# Altium schematic sheet TOP.SchDoc
size A4; Organization: Altium Limited; Address1: L3, 12a Rodborough Rd; Address2: Frenchs Forest; Address3: NSW; Address4: Australia 2086
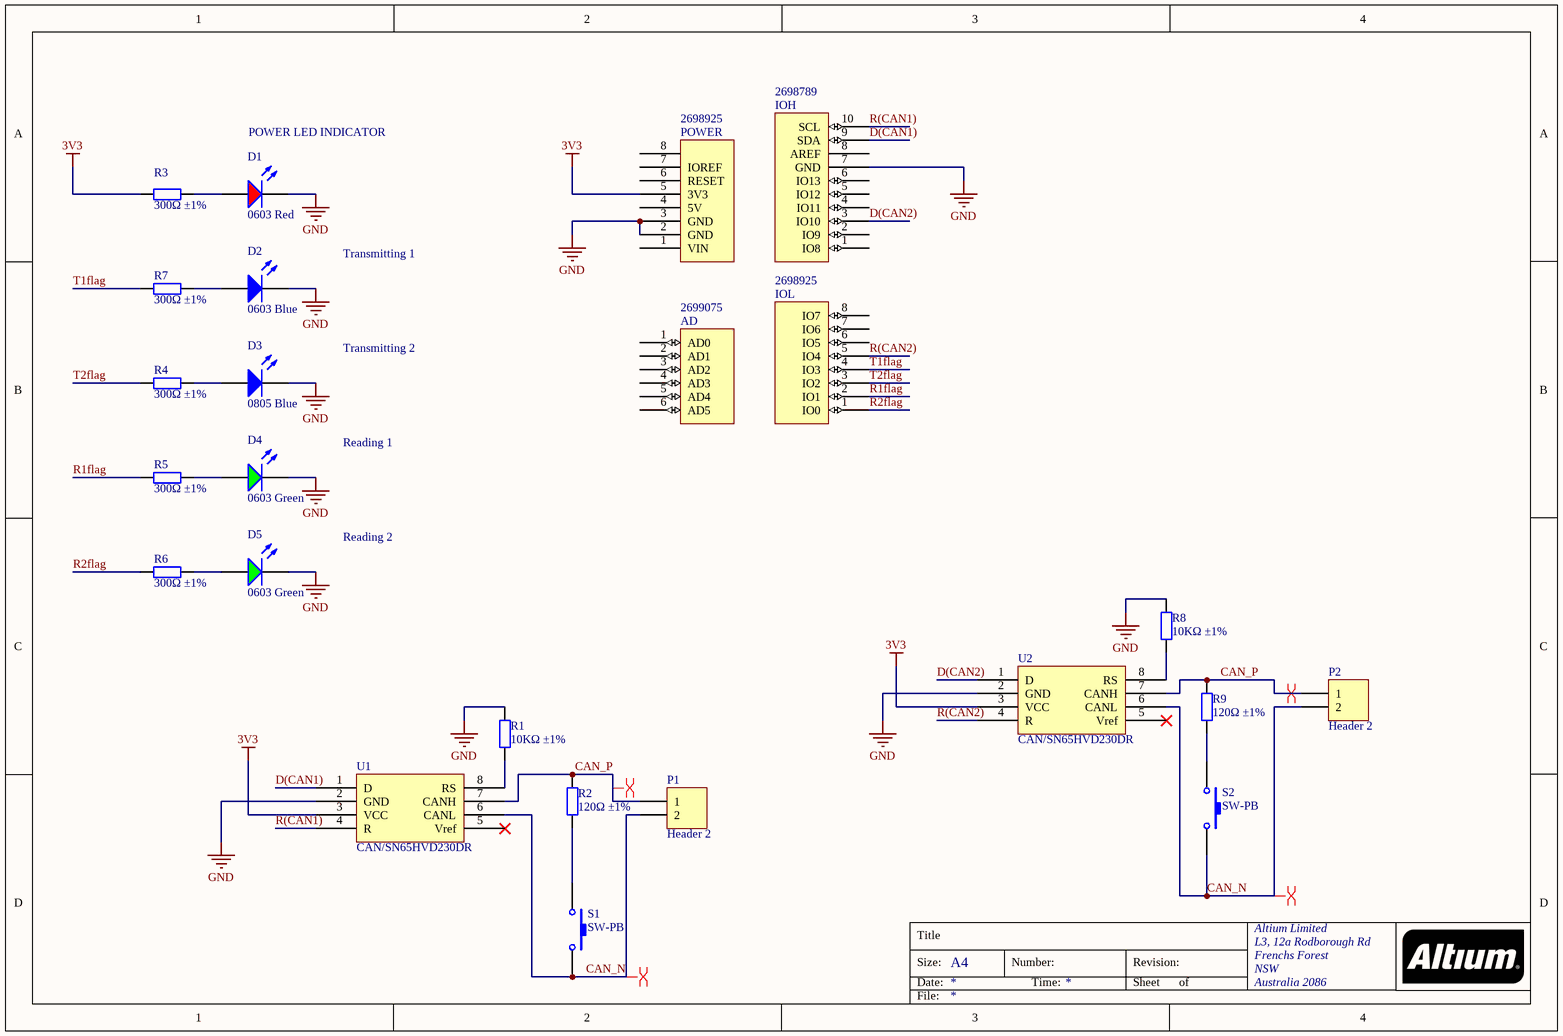
[diagram p0: TOP.SchDoc]

## Parts
AD  Supplier Part Number 4: 2699075  [Header 6x1 8.5mm]  (hidden comment: AD)
D1  0603 Red  [0603_LED_S1]
D2  0603 Blue  [0603_LED_S1]
D3  0805 Blue  [0805_LED_S1]
D4  0603 Green  [0603_LED_S1]
D5  0603 Green  [0603_LED_S1]
IOH  Supplier Part Number 3: 2698789  [Header 10x1 8.5mm]  (hidden comment: IOH)
IOL  Supplier Part Number 4: 2698925  [Header 8x1 8.5mm]  (hidden comment: IOL)
P1  Header 2  [HDR1X2]
P2  Header 2  [HDR1X2]
POWER  Supplier Part Number 4: 2698925  [Header 8x1 8.5mm]  (hidden comment: POWER_UNO)
R1  10KΩ ±1%  [0603_R]
R2  120Ω ±1%  [0603_R]
R3  300Ω ±1%  [0603_R]
R4  300Ω ±1%  [0603_R]
R5  300Ω ±1%  [0603_R]
R6  300Ω ±1%  [0603_R]
R7  300Ω ±1%  [0603_R]
R8  10KΩ ±1%  [0603_R]
R9  120Ω ±1%  [0603_R]
S1  SW-PB  [SPST-2]
S2  SW-PB  [SPST-2]
U1  CAN/SN65HVD230DR  [SOIC-8_150mil]
U2  CAN/SN65HVD230DR  [SOIC-8_150mil]

## Nets
3V3: POWER.5(3V3) R3.1 U1.3(VCC) U2.3(VCC)
GND: D1.K D2.K D3.K D4.K D5.K IOH.7(GND) POWER.2(GND) POWER.3(GND) R1.2 R8.2 U1.2(GND) U2.2(GND)
CAN_N: P1.2 P2.2 S1.2 S2.2 U1.6(CANL) U2.6(CANL)
CAN_P: P1.1 P2.1 R2.2 R9.2 U1.7(CANH) U2.7(CANH)
D(CAN1): IOH.9(SDA) U1.1(D)
D(CAN2): IOH.3(IO10) U2.1(D)
R1flag: IOL.2(IO1) R5.1
R2flag: IOL.1(IO0) R6.1
R(CAN1): IOH.10(SCL) U1.4(R)
R(CAN2): IOL.5(IO4) U2.4(R)
T1flag: IOL.4(IO3) R7.1
T2flag: IOL.3(IO2) R4.1
NetD1_A: D1.A R3.2
NetD2_A: D2.A R7.2
NetD3_A: D3.A R4.2
NetD4_A: D4.A R5.2
NetD5_A: D5.A R6.2
NetR1_1: R1.1 U1.8(RS)
NetR2_1: R2.1 S1.1
NetR8_1: R8.1 U2.8(RS)
NetR9_1: R9.1 S2.1

Not connected (* = marked no-connect by the designer): AD 1(AD0) 2(AD1) 3(AD2) 4(AD3) 5(AD4) 6(AD5); IOH 1(IO8) 2(IO9) 4(IO11) 5(IO12) 6(IO13) 8(AREF); IOL 6(IO5) 7(IO6) 8(IO7); POWER 1(VIN) 4(5V) 6(RESET) 7(IOREF) 8; U1 5(Vref)*; U2 5(Vref)*

## Layout directives
differential pair: CAN_N, CAN_P

## Notes on the sheet
- POWER LED INDICATOR
- Transmitting 1
- Transmitting 2
- Reading 1
- Reading 2
- Title
- Size:
- Date:
- A4
- Number:
- Time:
- Revision:
- Sheet
- of
- File:

## Library data of the parts
D1 = 0603 LED Red: LED; ComponentLink1Description: 供应商链接; ComponentLink1URL: http://www.szlcsc.com/product/details_2659.html; Package: 0603; Supplier: LC; SuppliersPartNumber: C2286; Color: Red
D2 = 0603 LED Blue: LED; ComponentLink1Description: 供应商链接; ComponentLink1URL: http://www.szlcsc.com/product/details_73150.html; Package: 0603; Supplier: LC; SuppliersPartNumber: C72041; Color: Blue
D3 = 0805 LED Blue: LED; ComponentLink1Description: 供应商链接; ComponentLink1URL: http://www.szlcsc.com/product/details_2666.html; Package: 0805; Supplier: LC; SuppliersPartNumber: C2293; Color: Blue
D4 D5 = 0603 LED Green: LED; ComponentLink1Description: 供应商链接; ComponentLink1URL: http://www.szlcsc.com/product/details_73152.html; Package: 0603; Supplier: LC; SuppliersPartNumber: C72043; Color: Green
P1 P2 = Header 2: Header, 2-Pin; LatestRevisionDate: 17-Jul-2002; LatestRevisionNote: Re-released for DXP Platform.; Publisher: Altium Limited
R1 R8 = 0603 10K (1002) 1%: Chip resistor; Manufacturer: Uniroyal Elec; PartNumber: 0603WAF1002T5E; Power: 1/10W; ComponentLink1Description: Supplier link; ComponentLink1URL: http://www.szlcsc.com/product/details_26547.html; Package: 0603; Supplier: LC; SuppliersPartNumber: C25804; Resistance: 10KΩ; Tolerance: 1%
R2 R9 = 0603 120R (1200) 1%: Chip resistor; Manufacturer: Uniroyal Elec; PartNumber: 0603WAF1200T5E; Power: 1/10W; ComponentLink1Description: Supplier link; ComponentLink1URL: http://www.szlcsc.com/product/details_23514.html; Package: 0603; Supplier: LC; SuppliersPartNumber: C22787; Resistance: 120Ω; Tolerance: 1%
R3-R7 = 0603 300R (3000) 1%: Chip resistor; Manufacturer: Uniroyal Elec; PartNumber: 0603WAF3000T5E; Power: 1/10W; ComponentLink1Description: Supplier link; ComponentLink1URL: http://www.szlcsc.com/product/details_23752.html; Package: 0603; Supplier: LC; SuppliersPartNumber: C23025; Resistance: 300Ω; Tolerance: 1%
S1 S2 = SW-PB: Switch; Published: 24-Mar-1999; LatestRevisionDate: 17-Jul-2002; LatestRevisionNote: Re-released for DXP Platform.; PackageReference: SPST-2; Publisher: Altium Limited; PackageDescription: Switch; 2 Leads
U1 U2 = CAN/SN65HVD230DR_[C12084]: CAN; ComponentLink1Description: 供应商链接; ComponentLink1URL: http://www.szlcsc.com/product/details_12661.html; Package: SOIC-8_150mil; Supplier: LC; SuppliersPartNumber: C12084
AD = AD: Supplier 1: Arrow; Supplier Part Number 1: 2699089; Supplier 2: Digi-Key; Supplier Part Number 2: SAM1198-06-ND; Supplier 3: Arrow; Supplier Part Number 3: 2699088; Supplier 4: Arrow
IOH = IOH: Supplier 1: Arrow; Supplier Part Number 1: 2698803S4475693N1004; Supplier 2: Digi-Key; Supplier Part Number 2: SAM1198-10-ND; Supplier 3: Arrow
IOL = IOL: Supplier 1: Digi-Key; Supplier Part Number 1: SAM1198-08-ND; Supplier 2: Arrow; Supplier Part Number 2: 2698939; Supplier 3: Arrow; Supplier Part Number 3: 2698940; Supplier 4: Arrow
POWER = POWER_UNO: Supplier 1: Digi-Key; Supplier Part Number 1: SAM1198-08-ND; Supplier 2: Arrow; Supplier Part Number 2: 2698939; Supplier 3: Arrow; Supplier Part Number 3: 2698940; Supplier 4: Arrow